# Altium project PowerArduino.PrjPcb
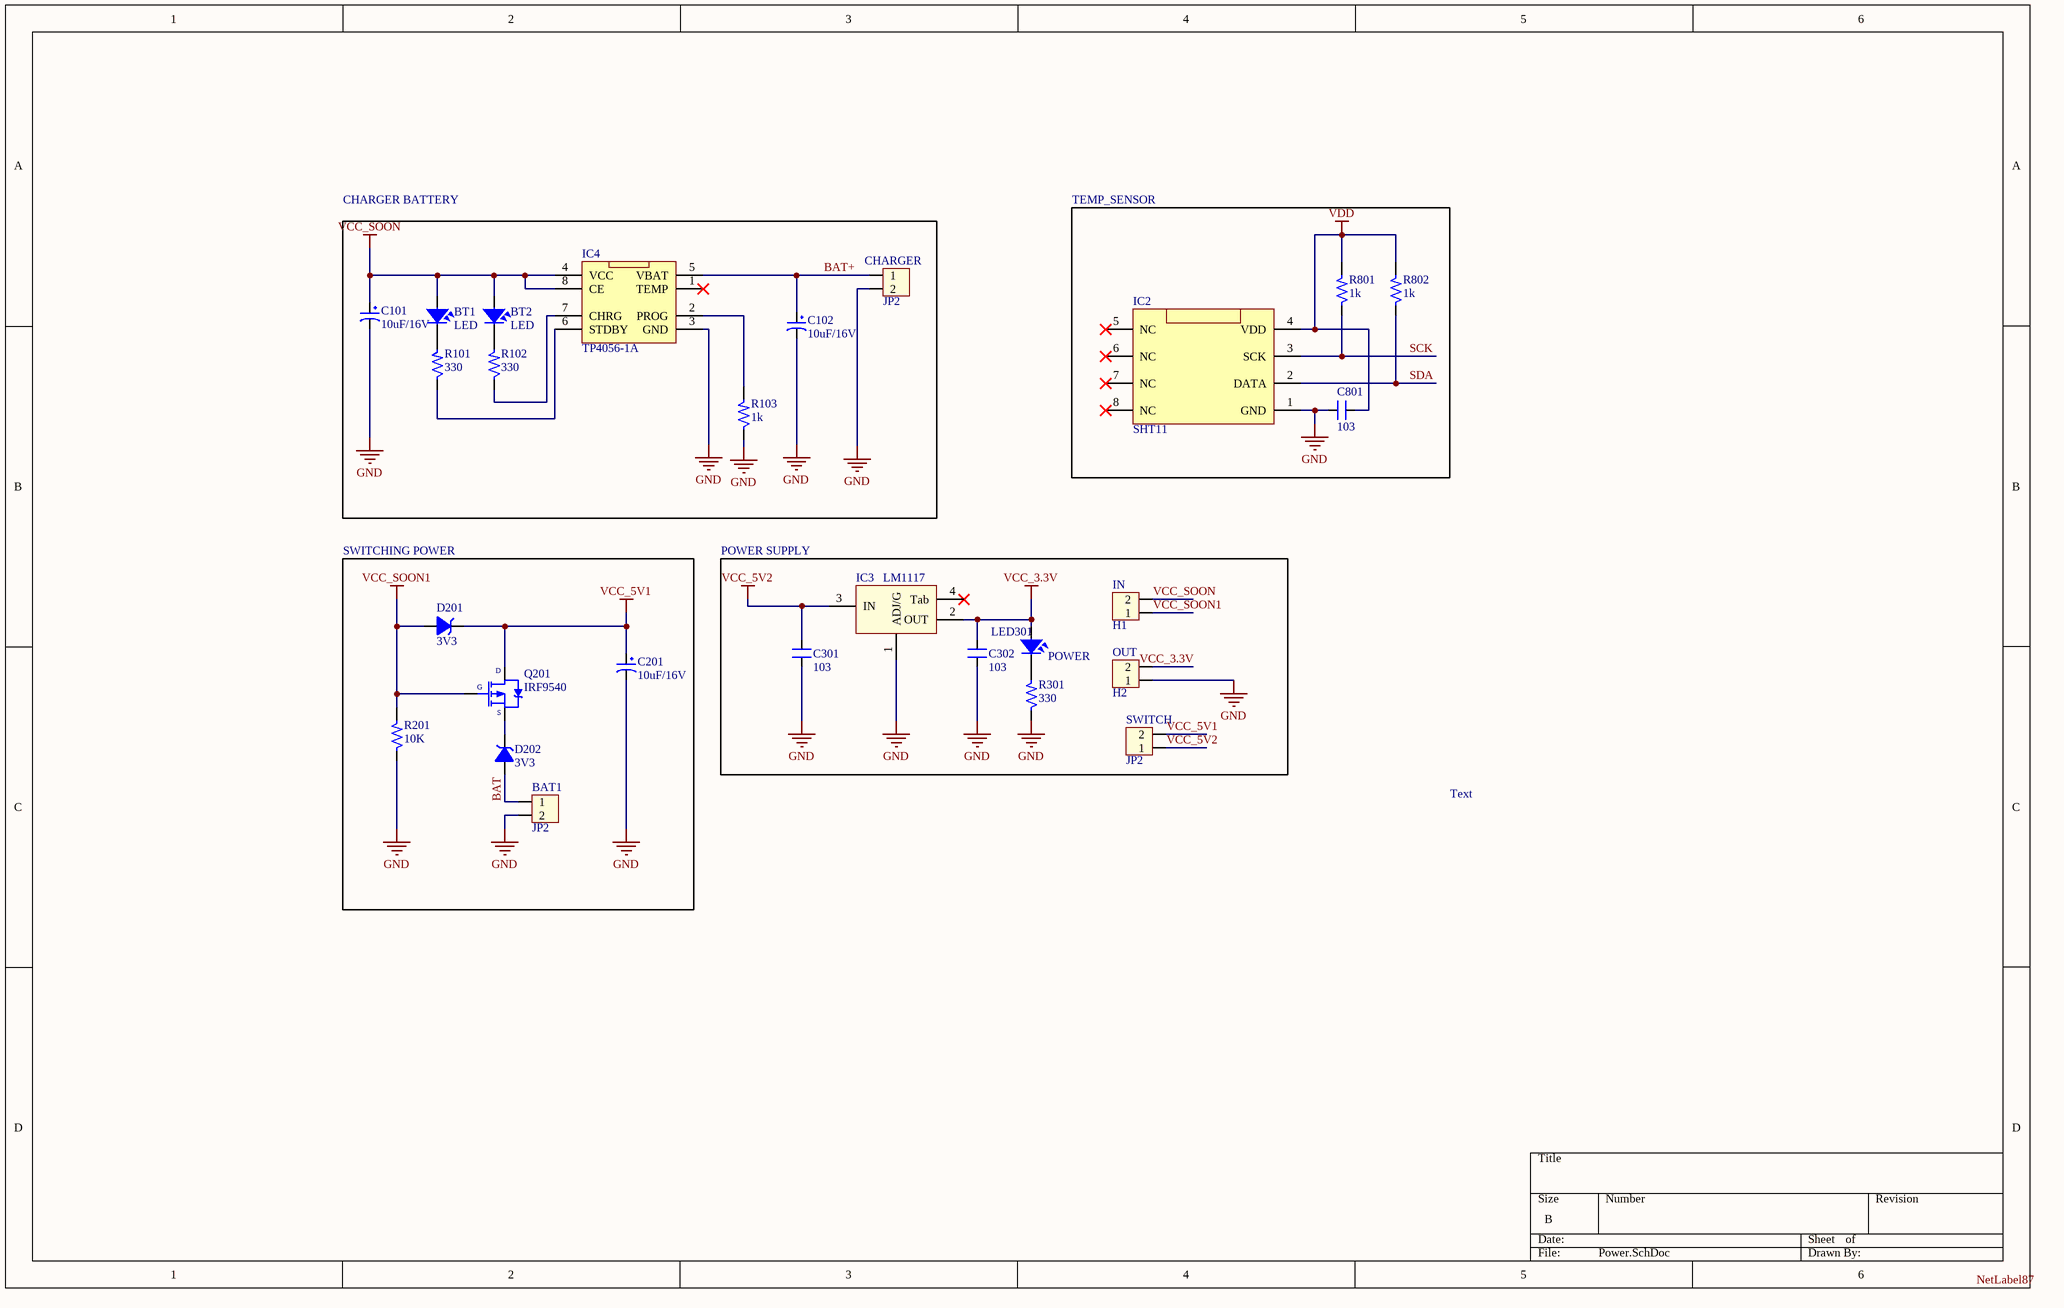
[diagram p0: Power.SchDoc]
1 sheet, 27 parts. Net scope: global (net labels, ports and power ports of the same name join across sheets).
Board file: Power.PcbDoc

## Sheet Power.SchDoc
size B

### Parts
BAT1  JP2  [CON2]
BT1  LED  [LED0805-Blue]
BT2  LED  [LED0805-Blue]
C101  10uF/16V  [CAP-B-22UF/16V]
C102  10uF/16V  [CAP-B-22UF/16V]
C201  10uF/16V  [CAP-B-22UF/16V]
C301  103  [SM-0805]
C302  103  [SM-0805]
C801  103  [SM-0805]
CHARGER  JP2  [CON2]
D201  3V3  [Diode1206]
D202  3V3  [Diode1206]
IC2  SHT11
IC3  LM1117  [SOT223-4N]
IC4  TP4056-1A  [TP4056-1A]
IN  H1  [CON2]
LED301  POWER  [LED0805-Blue]
OUT  H2  [CON2]
Q201  IRF9540  [SOT23A]
R101  330  [SM-0805]
R102  330  [SM-0805]
R103  1k  [SM-0805]
R201  10K  [SM-0805]
R301  330  [SM-0805]
R801  1k  [SM-1206]
R802  1k  [SM-1206]
SWITCH  JP2  [CON2]

### Blocks framed on the sheet
CHARGER BATTERY: BT1 BT2 C101 C102 CHARGER IC4 R101-R103
TEMP_SENSOR: C801 IC2 R801 R802
SWITCHING POWER: BAT1 C201 D201 D202 Q201 R201
POWER SUPPLY: C301 C302 IC3 IN LED301 OUT R301 SWITCH

### Nets
GND: BAT1.2 C101.2 C102.2 C201.2 C301.1 C302.1 C801.2 CHARGER.2 IC2.1(GND) IC3.1(ADJ/G) IC4.3(GND) OUT.1 R103.1 R201.1 R301.1
VCC_3.3V: C302.2 IC3.2(OUT) LED301.1
VCC_5V1: C201.1 D201.2(K) Q201.2(D) SWITCH.2
VCC_5V2: C301.2 IC3.3(IN) SWITCH.1
VCC_SOON: BT1.1 BT2.1 C101.1 IC4.4(VCC) IC4.8(CE) IN.2
VCC_SOON1: D201.1(A) IN.1 Q201.1(G) R201.2
VDD: C801.1 IC2.4(VDD) R801.2 R802.2
BAT: BAT1.1 D202.1(A)
BAT+: C102.1 CHARGER.1 IC4.5(VBAT)
SCK: IC2.3(SCK) R801.1
SDA: IC2.2(DATA) R802.1
NetBT1_2: BT1.2 R101.2
NetBT2_2: BT2.2 R102.2
NetD202_2: D202.2(K) Q201.3(S)
NetIC4_2: IC4.2(PROG) R103.2
NetIC4_6: IC4.6(STDBY) R101.1
NetIC4_7: IC4.7(CHRG) R102.1
NetLED301_2: LED301.2 R301.2

Not connected (* = marked no-connect by the designer): IC2 5(NC)* 6(NC)* 7(NC)* 8(NC)*; IC3 4(Tab)*; IC4 1(TEMP)*; OUT 2

### Notes on the sheet
- Text
- Labels drawn without touching a wire or pin: NetLabel87, VCC_3.3V

### Library data of the parts
BAT1 CHARGER SWITCH = Con2: Connector 2; Value: Connector 2
BT1 BT2 LED301 = LED: LED Single colour Green and Red; Value: LED 3 ly Single Colour
C101 C102 C201 = CP3: Cap 100uF/35V - 470uF/16V; Value: 100uF/35V/50V; Description 1: 1000uF/6,3V - 470uF/16V - 330uF - 25V; Description 2: 220uF/35V - 100uF/50V - 63V - 4,7uF/200V; Description 3: 22uF => 33uF100V - 3,3uF => 4,7uF/250V; Description 4: 2,2uF =>3,3uF/350 - 2,2uF/400V - 1uF/450V
C301 C302 C801 = CM: Cap SMD; Value: 103
D201 D202 = DZ: Diode Zenner; Value: 3v3
IC3 = LM1117: 3v3; Value: LM317
IN OUT = Hed2: Header 2 (Green); Value: Header 2
Q201 = IRF9540: HEXFET P-Channel Power MOSFET; Note: Pin 2 is electrically connected to pin 4.; Published: 8-Jun-2000; LatestRevisionDate: 17-Jul-2002; LatestRevisionNote: Re-released for DXP Platform.; DatasheetVersion: PD-9.421C; PackageVersion: Feb-1997; PackageReference: TO-220AB; Publisher: Altium Limited; PackageDescription: TO, Thru-Hole, Vertical, Heatsink Mounted; 3 In-Line Leads; Pitch 2.54 mm; ComponentLink1Description: Manufacturer Link; ComponentLink1URL: http://www.irf.com/; ComponentLink2Description: Datasheet; ComponentLink2URL: http://www.irf.com/product-info/datasheets/data/irf9540.pdf
R101-R103 R201 R301 R801 R802 = R: Resistor 1/4W; Value: R1/4W - 1K